# Altium schematic sheet STM32 Control.SchDoc
size A; SheetNumber: 2; SheetTotal: 3
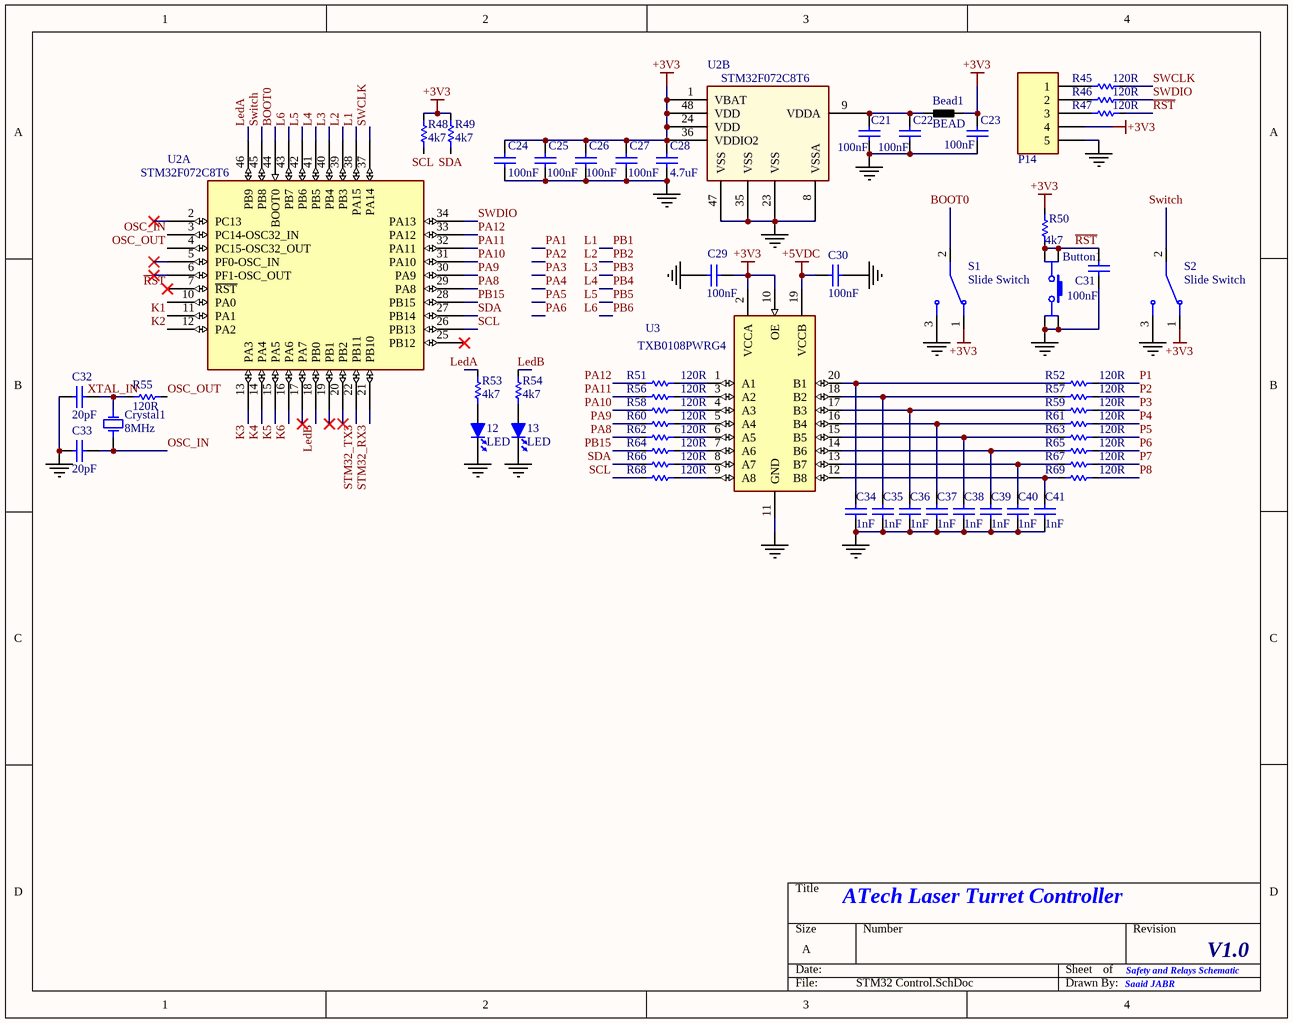
[diagram p0: STM32 Control.SchDoc]

## Parts
12  LED  [LED1206]
13  LED  [LED1206]
Bead1  BEAD  [CL3216-1206L]
Button1  SWITCH TACT  [SWITCH TACTILE SMD 6x6 4.3mm]  (value not drawn)
C21  100nF  [CC3216-1206L]
C22  100nF  [CC3216-1206L]
C23  100nF  [CC3216-1206L]
C24  100nF  [CC3216-1206L]
C25  100nF  [CC3216-1206L]
C26  100nF  [CC3216-1206L]
C27  100nF  [CC3216-1206L]
C28  4.7uF  [CC3216-1206L]
C29  100nF  [CC3216-1206L]
C30  100nF  [CC3216-1206L]
C31  100nF  [CC3216-1206L]
C32  20pF  [CC3216-1206L]
C33  20pF  [CC3216-1206L]
C34  1nF  [CC3216-1206L]
C35  1nF  [CC3216-1206L]
C36  1nF  [CC3216-1206L]
C37  1nF  [CC3216-1206L]
C38  1nF  [CC3216-1206L]
C39  1nF  [CC3216-1206L]
C40  1nF  [CC3216-1206L]
C41  1nF  [CC3216-1206L]
Crystal1  8MHz  [HC49S SMD]
P14  CONNECTOR, 1x5, 5P  [HDR_MALE_1X5_5P_2.54MM_180]  (value not drawn)
R45  120R  [CR3216-1206l]
R46  120R  [CR3216-1206l]
R47  120R  [CR3216-1206l]
R48  4k7  [CR3216-1206l]
R49  4k7  [CR3216-1206l]
R50  4k7  [CR3216-1206l]
R51  120R  [CR3216-1206l]
R52  120R  [CR3216-1206l]
R53  4k7  [CR3216-1206l]
R54  4k7  [CR3216-1206l]
R55  120R  [CR3216-1206l]
R56  120R  [CR3216-1206l]
R57  120R  [CR3216-1206l]
R58  120R  [CR3216-1206l]
R59  120R  [CR3216-1206l]
R60  120R  [CR3216-1206l]
R61  120R  [CR3216-1206l]
R62  120R  [CR3216-1206l]
R63  120R  [CR3216-1206l]
R64  120R  [CR3216-1206l]
R65  120R  [CR3216-1206l]
R66  120R  [CR3216-1206l]
R67  120R  [CR3216-1206l]
R68  120R  [CR3216-1206l]
R69  120R  [CR3216-1206l]
S1  Slide Switch  [SSL-12F20-G4-P]
S2  Slide Switch  [SSL-12F20-G4-P]
U2  STM32F072C8T6  [QFP50P900X900X160-48N]  (parts A,B of 2)
U3  TXB0108PWRG4  [SOP65P640X120-20N]

## Nets
+3V3: Bead1.1 C23.1 C24.1 C25.1 C26.1 C27.1 C28.1 C29.1 P14.4 R48.2 R49.2 R50.2 S1.1(NC) S2.1(NC) U2.1(VBAT) U2.24(VDD) U2.36(VDDIO2) U2.48(VDD) U3.2(VCCA) U3.10(OE)
+5VDC: C30.1 U3.19(VCCB)
GND: 12.2(CATHODE) 13.2(CATHODE) Button1.3(B) Button1.4(B) C21.2 C22.2 C23.2 C24.2 C25.2 C26.2 C27.2 C28.2 C29.2 C30.2 C31.2 C32.1 C33.1 C34.2 C35.2 C36.2 C37.2 C38.2 C39.2 C40.2 C41.2 P14.5 S1.3(NO) S2.3(NO) U2.8(VSSA) U2.23(VSS) U2.35(VSS) U2.47(VSS) U3.11(GND)
BOOT0: S1.2(COM) U2.44(BOOT0)
K1: U2.11(PA1)
K2: U2.12(PA2)
K3: U2.13(PA3)
K4: U2.14(PA4)
K5: U2.15(PA5)
K6: U2.16(PA6)
L1: U2.38(PA15)  [also labelled PB1]
L2: U2.39(PB3)  [also labelled PB2]
L3: U2.40(PB4)  [also labelled PB3]
L4: U2.41(PB5)  [also labelled PB4]
L5: U2.42(PB6)  [also labelled PB5]
L6: U2.43(PB7)  [also labelled PB6]
LedA: R53.2 U2.46(PB9)
LedB: R54.2 U2.18(PB0)
OSC_IN: C33.2 Crystal1.1(OSC1) U2.3(PC14-OSC32_IN)
OSC_OUT: R55.1 U2.4(PC15-OSC32_OUT)
P1: R52.2
P2: R57.2
P3: R59.2
P4: R61.2
P5: R63.2
P6: R65.2
P7: R67.2
P8: R69.2
PA8: R62.1 U2.29(PA8)
PA9: R60.1 U2.30(PA9)
PA10: R58.1 U2.31(PA10)
PA11: R56.1 U2.32(PA11)
PA12: R51.1 U2.33(PA12)
PB15: R64.1 U2.28(PB15)
~{RST}: Button1.1(A) Button1.2(A) C31.1 R46.2 R50.1 U2.7(~{RST})
SCL: R48.1 R68.1 U2.26(PB13)
SDA: R49.1 R66.1 U2.27(PB14)
STM32_RX3: U2.21(PB10)
STM32_TX3: U2.22(PB11)
SWCLK: R45.2 U2.37(PA14)
SWDIO: R47.2 U2.34(PA13)
Switch: S2.2(COM) U2.45(PB8)
XTAL_IN: C32.2 Crystal1.2(OSC2) R55.2
Net12_1: 12.1(ANODE) R53.1
Net13_1: 13.1(ANODE) R54.1
NetBead1_2: Bead1.2 C21.1 C22.1 U2.9(VDDA)
NetC34_1: C34.1 R52.1 U3.20(B1)
NetC35_1: C35.1 R57.1 U3.18(B2)
NetC36_1: C36.1 R59.1 U3.17(B3)
NetC37_1: C37.1 R61.1 U3.16(B4)
NetC38_1: C38.1 R63.1 U3.15(B5)
NetC39_1: C39.1 R65.1 U3.14(B6)
NetC40_1: C40.1 R67.1 U3.13(B7)
NetC41_1: C41.1 R69.1 U3.12(B8)
NetP14_1: P14.1 R45.1
NetP14_2: P14.2 R47.1
NetP14_3: P14.3 R46.1
NetR51_2: R51.2 U3.1(A1)
NetR56_2: R56.2 U3.3(A2)
NetR58_2: R58.2 U3.4(A3)
NetR60_2: R60.2 U3.5(A4)
NetR62_2: R62.2 U3.6(A5)
NetR64_2: R64.2 U3.7(A6)
NetR66_2: R66.2 U3.8(A7)
NetR68_2: R68.2 U3.9(A8)

Not connected (* = marked no-connect by the designer): U2 2(PC13)* 5(PF0-OSC_IN)* 6(PF1-OSC_OUT)* 10(PA0) 17(PA7)* 19(PB1)* 20(PB2)* 25(PB12)*

## Notes on the sheet
- ATech Laser Turret Controller
- Safety and Relays Schematic
- V1.0
- Saaid JABR

## Library data of the parts
12 13 = LED: Ozdisan: HL-PC-3216U51GC; Stock Code: *; Component Type: Diode; PriceUSD: 0.0016
Bead1 = BEAD: FERRITE BEAD; Ozdisan: LCB3216-100Y-N; Stock Code: *; Component Type: Inductor; PriceUSD: 0.002305
Button1 = SWITCH TACT: TACT SWITCH; Ozdisan: DTSM-61S-V-T/R; Stock Code: *; Component Type: Switch; PriceUSD: 0.22264
C21-C27 C29-C31 = CAPACITOR NON-POL: Capacitor; Ozdisan: CL31B104KCFNNNE; Stock Code: *; Component Type: Capacitor; PriceUSD: 0.001135
C28 = CAPACITOR NON-POL: Capacitor; Ozdisan: CL31B475KBHNNNE; Stock Code: *; Component Type: Capacitor; PriceUSD: 0.016518
C32 C33 = CAPACITOR NON-POL: Capacitor; Ozdisan: CL31C220JBCNNNC; Stock Code: *; Component Type: Capacitor; PriceUSD: 0.006466
C34-C41 = CAPACITOR NON-POL: Capacitor; Ozdisan: CL31B102KBCNNNC; Stock Code: *; Component Type: Capacitor; PriceUSD: 0.00127
Crystal1 = XTAL: Ozdisan: AS-8.OOO-20-SMD-TR; Stock Code: *; Component Type: XTAL; PriceUSD: 0.070265
R45-R47 R51 R52 R55-R69 = RESISTOR: Ozdisan: RC1206JR-07120RL; Component Type: Resistor; PriceUSD: 0.0000351
R48-R50 R53 R54 = RESISTOR: Ozdisan: RC1206JR-074K7L; Component Type: Resistor; PriceUSD: 0.0000351
S1 S2 = Slide Switch: Slide Switch SPDT Through Hole; MP: 500SSP1S2M2QEA; Package: None; Value: *; Price: None; Availability: Unavailable
U2 = STM32F072C8T6: ARMÂ® CortexÂ®-M0 STM32F0 Microcontroller IC 32-Bit Single-Core 48MHz 64KB (64K x 8) FLASH 48-LQFP (7x7); MF: STMicroelectronics; SnapEDA_Link: https://www.snapeda.com/parts/STM32F072C8T6/STMicroelectronics/view-part/?ref=snap; Package: LQFP-48 STMicroelectronics; Value: *; MP: STM32F072C8T6; Check_prices: https://www.snapeda.com/parts/STM32F072C8T6/STMicroelectronics/view-part/?ref=eda
U3 = TXB0108PWRG4: 8-Bit Bidirectional Voltage-Level Shifter with Auto Direction Sensing and +/-15-kV ESD Protect 20-TSSOP -40 to 85; MF: Texas Instruments; Value: *; Check_prices: https://www.snapeda.com/parts/TXB0108PWRG4/Texas+Instruments/view-part/?ref=eda; SnapEDA_Link: https://www.snapeda.com/parts/TXB0108PWRG4/Texas+Instruments/view-part/?ref=snap; Availability: In Stock; MP: TXB0108PWRG4; Purchase-URL: https://pricing.snapeda.com/search/part/TXB0108PWRG4/?ref=eda; Package: TSSOP-20 Texas Instruments; Price: None
P14 = CONNECTOR, 1x5, 5P: Component Type: Connector